# EAGLE design MagicBeater (EAGLE 9.2.0)
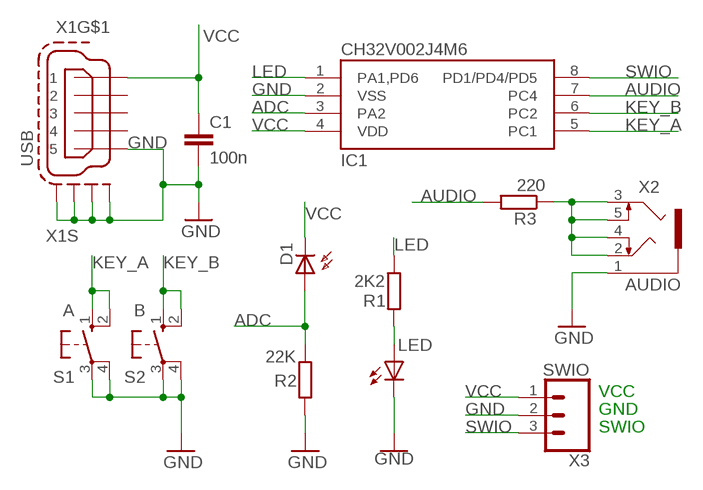
[diagram p0: schematic, sheet 1]

## Parts
C1  100n  C-EU050-024X044  [C050-024X044]
D1  BPW32  [BPW32]
IC1  CH32V002J4M6  CH32V003J4M6  [SOP8]
LED  LEDLED5MMB  [LED5MMB]
R1  2K2  R-EU_0204/7  [0204/7]
R2  22K  R-EU_0204/7  [0204/7]
R3  220  R-EU_0204/7  [0204/7]
S1  A  10-XX  [B3F-10XX]
S2  B  10-XX  [B3F-10XX]
X1  USB  MINI-USB-SCHIELD-32005-201  [32005-201]
X2  AUDIO  1503_09  [1503_09]
X3  SWIO  CONN_03LONGPADS  [1X03_LONGPADS]

## Nets
ADC: D1.A IC1.3(PA2) R2.1
AUDIO: IC1.7(PC4) R3.2
GND: C1.2 IC1.2(VSS) LED.K(C) R2.2 S1.3(P) S1.4(P1) S2.3(P) S2.4(P1) X1.5 X1.M1(S:S1) X1.M2(S:S2) X1.M3(S:S3) X1.M4(S:S4) X2.1 X3.2
KEY_A: IC1.5(PC1) S1.1(S) S1.2(S1)
KEY_B: IC1.6(PC2) S2.1(S) S2.2(S1)
LED: IC1.1(PA1,PD6) R1.1
N$2: LED.A R1.2
N$7: R3.1 X2.2 X2.3 X2.4 X2.5
SWIO: IC1.8(PD1/PD4/PD5) X3.3
VCC: C1.1 D1.K(C) IC1.4(VDD) X1.1 X3.1
Unconnected: X1.2 X1.3 X1.4

## Notes on the sheet
- VCC
- GND
- SWIO

## Library data of the parts
C1 = rcl:C-EU: CAPACITOR, European symbol; SPICEPREFIX: C
D1 = opto-trans-siemens:BPW32: PHOTO DIODE; OC_FARNELL: unknown; OC_NEWARK: unknown
IC1 = CH32V:CH32V003J4M6
LED = adafruit_B:LED: LED OSRAM: - CHIPLED LG R971, LG N971, LY N971, LG Q971, LY Q971, LO R971, LY R971 LH N974, LH R974 LS Q976, LO Q976, LY Q976 LO Q996 - Hyper CHIPLED LW Q18S LB Q993, LB Q99A, LB R99A - SideLED LS A670, LO A670, LY A670, LG A670, LP A670 LB A673, LV A673, LT A673, LW A673 LH A674 LY A675 LS A676, LA A676, LO A676, LY A676, LW A676 LS A679, LY A679, LG A679 - Hyper Micro SIDELED® LS Y876, LA Y876, LO Y876, LY Y876 LT Y87S - SmartLED LW L88C, LW L88S LB L89C, LB L89S, LG L890 LS L89K, LO L89K, LY L89K LS L896, LA L896, LO L896, LY L896 - TOPLED LS T670, LO T670, LY T670, LG T670, LP T670 LSG T670, LSP T670, LSY T670, LOP T670, LYG T670 LG T671, LOG T671, LSG T671 LB T673, LV T673, LT T673, LW T673 LH T674 LS T676, LA T676, LO T676, LY T676, LB T676, LH T676, LSB T676, LW T676 LB T67C, LV T67C, LT T67C, LS T67K, LO T67K, LY T67K, LW E67C LS E67B, LA E67B, LO E67B, LY E67B, LB E67C, LV E67C, LT E67C LW T67C LS T679, LY T679, LG T679 LS T770, LO T770, LY T770, LG T770, LP T770 LB T773, LV T773, LT T773, LW T773 LH T774 LS E675, LA E675, LY E675, LS T675 LS T776, LA T776, LO T776, LY T776, LB T776 LHGB T686 LT T68C, LB T68C - Hyper Mini TOPLED® LB M676 - Mini TOPLED Santana® LG M470 LS M47K, LO M47K, LY M47K Source: http://www.osram.convergy.de/
R1-R3 = rcl:R-EU_: RESISTOR, European symbol; SPICEPREFIX: R
S1 S2 = switch-omron:10-XX: OMRON SWITCH; MPN: B3F-1000; OC_FARNELL: 176432; OC_NEWARK: 36M3542
X1 = con-cypressindustries:MINI-USB-SCHIELD-: MINI USB-B Conector Source: www.cypressindustries.com; OC_FARNELL: unknown; OC_NEWARK: unknown
X2 = con-lumberg:1503_09: Jack connectors according to JISC 6560, 3.5 mm Klinkeneinbaukupplung nach JISC 6560, 3,5 mm, 3-polig/ stereo, abgewinkelte Ausführung, mit 2 Öffnern und Lötaugen, für Leiterplatten Rückseitenmontage Source: http://www.lumberg.com/Produkte/PDFs/1503_09.pdf; OC_FARNELL: 1243244; OC_NEWARK: unknown
X3 = SparkFun-Connectors:CONN_03: Multi connection point. Often used as Generic Header-pin footprint for 0.1 inch spaced/style header connections On any of the 0.1 inch spaced packages, you can populate with these: Break Away Headers - Straight <https://www.sparkfun.com/products/116> (PRT-00116) Break Away Male Headers - Right Angle <https://www.sparkfun.com/products/553> (PRT-00553) Female Headers <https://www.sparkfun.com/products/115> (PRT-00115) Break Away Headers - Machine Pin <https://www.sparkfun.com/products/117> (PRT-00117) Break Away Female Headers - Swiss Machine Pin <https://www.sparkfun.com/products/743> (PRT-00743) Stackable Header - 3 Pin (Female, 0.1") <https://www.sparkfun.com/products/13875> (PRT-13875) For SCREWTERMINALS and SPRING TERMINALS visit here: Screw Terimnals on SparkFun.com <https://www.sparkfun.com/search/results?term=Screw+Terminals> (5mm/3.5mm/2.54mm spacing) This device is also useful as a general connection point to wire up your design to another part of your project. Our various solder wires solder well into these plated through hole pads. Hook-Up Wire - Assortment (Stranded, 22 AWG) <https://www.sparkfun.com/products/11375> (PRT-11375) Hook-Up Wire - Assortment (Solid Core, 22 AWG) <https://www.sparkfun.com/products/11367> (PRT-11367) View the entire wire category on our website here <https://www.sparkfun.com/categories/141> Special notes: Molex polarized connector foot print use with SKU : PRT-08232 with associated crimp pins and housings.

## Board
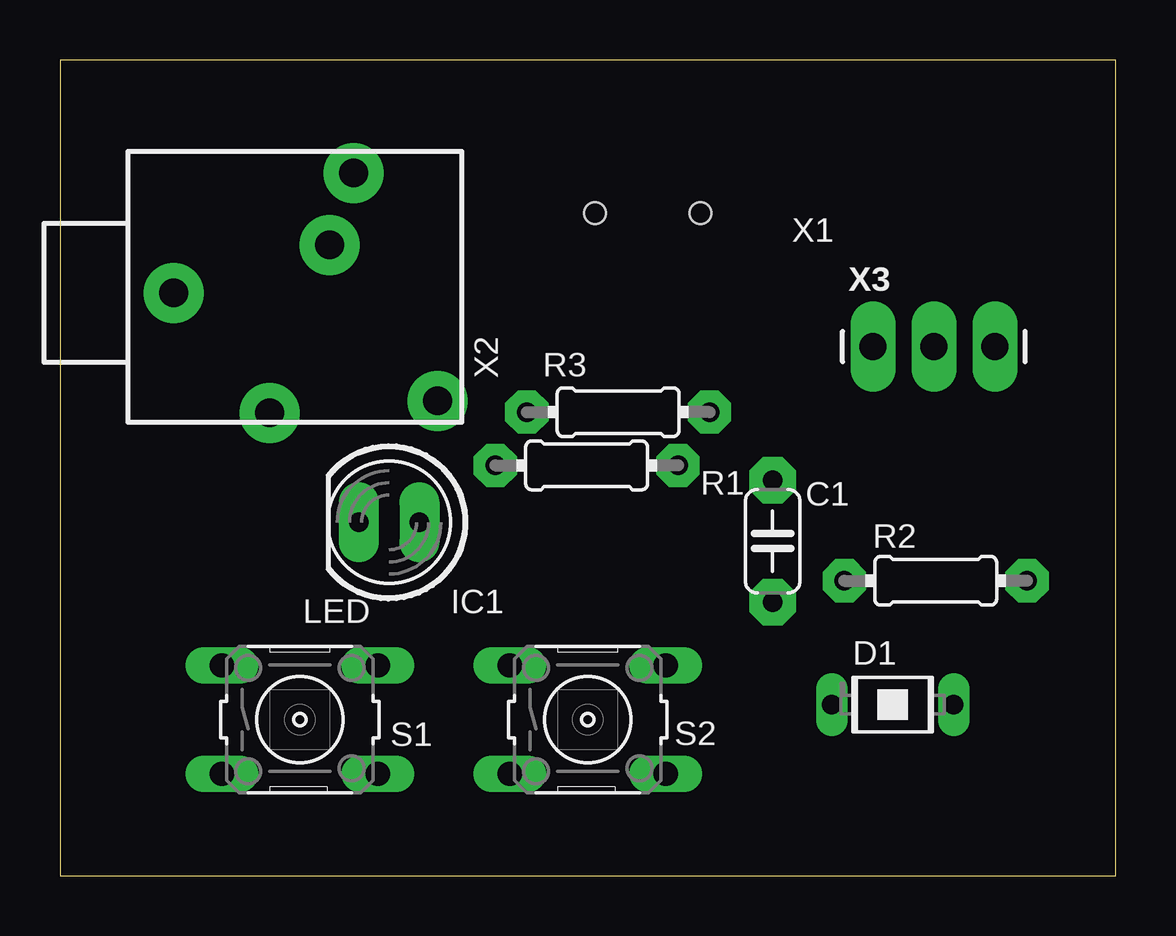
[diagram p1: board, top side]
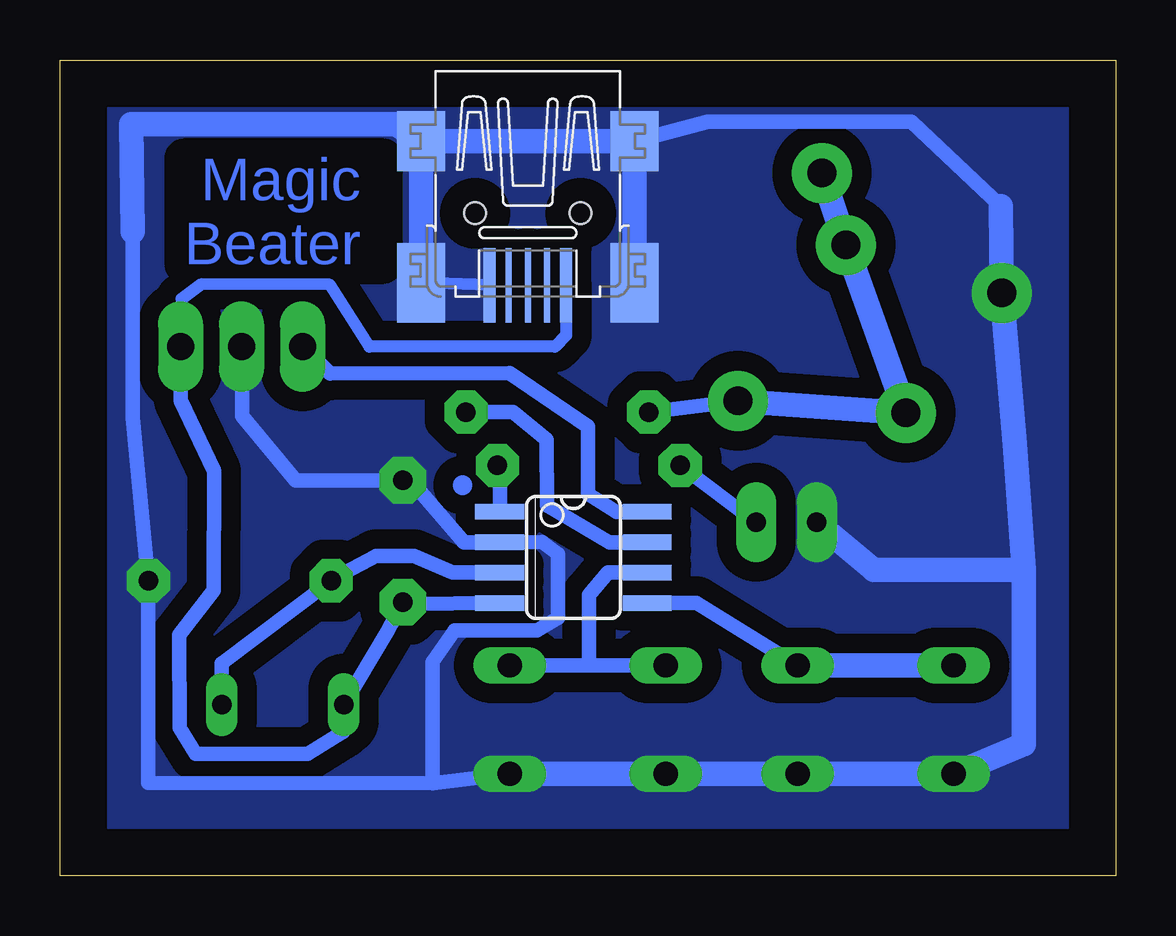
[diagram p2: board, bottom side, seen from below]

Size 44 x 34 mm. Coordinates in mm from the lower left corner, seen from the top.
Outline: 0,0 44,0 44,34 0,34 0,0
Copper layers (1*16): Top 0.035mm / dielectric 1.5mm / Bottom 0.035mm
Design rules "default": minimum track width 6mil, minimum drill 0.35mm, track to track 6mil, track to pad 6mil, pad to pad 6mil, via to via 6mil, smd to smd 6mil, copper to edge 40mil, drill to drill 6mil, minimum pad ring 10mil, minimum via ring 8mil, stop-mask expansion 4mil, vias tented up to drill 0mil, thermal gap 10mil

### Footprints (pad centres in the part's own frame; a part is rotated, then mirrored left to right if it is on the bottom)
C050-024X044 = drill 0.813 pad 1.93 octagon: 1 -2.54,0; 2 2.54,0
BPW32 = drill 0.813 long: A 0,2.54; K 0,-2.54
SOP8 = smd 0.66 x 2.032: 1 -1.905,-3.073; 2 -0.635,-3.073; 3 0.635,-3.073; 4 1.905,-3.073; 5 1.905,3.073; 6 0.635,3.073; 7 -0.635,3.073; 8 -1.905,3.073
LED5MMB = drill 0.813 pad 1.676 long: A -1.27,0; K 1.27,0
0204/7 = drill 0.813 pad 1.8 octagon: 1 -3.81,0; 2 3.81,0
B3F-10XX = drill 1.016 long: 1 -3.251,2.261; 2 3.251,2.261; 3 -3.251,-2.261; 4 3.251,-2.261
32005-201 = smd 3.1 x 0.5: 1 3,1.6; 5 3,-1.6 | smd 3.1 x 0.254: 2 3,0.8; 3 3,0; 4 3,-0.8 | smd 2.5 x 2: M1 -3,-4.45; M2 -3,4.45 | smd 3.3 x 2: M3 2.9,4.45; M4 2.9,-4.45 | hole 0.9: 0,2.2; 0,-2.2
1503_09 = drill 1.2 pad 2.5: 1 0,-2; 2 -5,-6; 3 5,-9.5; 4 -4.5,-13; 5 2,-8.5
1X03_LONGPADS = drill 1.118 pad 1.88 long: 1 0,0; 2 2.54,0; 3 5.08,0

### Placement (x,y rotation side)
C1  29.71,13.94 90 top
D1  34.71,7.12 270 top
IC1  22.6,13.26 270 bottom
LED  13.72,14.73 180 top
R1  21.96,17.1 180 top
R2  36.5,12.29 0 top
R3  23.27,19.32 0 top
S1  10,6.5 0 top
S2  22,6.5 0 top
X1  24.5,27.61 270 bottom
X2  2.74,24.29 90 top
X3  38.97,22.05 180 top

### Tracks (layer width: path | path; a pad name or v marks a point on that pad's centre or on a via)
ADC
  Bottom 0.61: IC1.3 27.64,12.63 29.23,13.31 30.83,13.31 32.46,12.45 R2.1 37.27,8.85 D1.A
AUDIO
  Bottom 0.61: R3.2 25.12,19.32 23.71,18.17 23.69,15.42 21.1,13.89 IC1.7
GND
  Bottom 0.508: X1.5 X1.M4
  Bottom 0.61: S2.4 28.47,3.85 | 28.47,3.85 40.32,3.86 R2.2 40.96,19.09 40.97,26.84 | 28.47,3.85 28.47,8.9 27.54,10.22 24.12,10.22 23.25,10.75 23.23,13.4 23.91,13.9 IC1.2 27.15,13.89 29.34,16.43 C1.2 34.17,16.48 36.41,19.16 X3.2 | X1.M2 16.98,31.42 8.51,31.42 4.79,27.91
  Bottom 1.016: S2.4 S2.3 S1.4 S1.3 3.82,5.47 3.83,12.73 | 40.97,26.84 41.02,31.32 29.96,31.33 X1.M1 | X1.M1 X1.M2 X1.M3 | 4.79,27.91 X2.1 4.2,18 3.83,12.73 | LED.K 10.07,12.73 3.83,12.73 | X1.M1 X1.M4
  pour Bottom (isolate 0.813, no thermals): 2,2 2,32 42,32 42,2
KEY_A
  Bottom 0.61: S1.2 17.46,11.36 IC1.5
  Bottom 1.016: S1.1 S1.2
KEY_B
  Bottom 0.61: S2.1 21.95,8.76 | 21.95,8.76 S2.2 | IC1.6 21.15,12.63 21.95,11.69 21.95,8.76
LED
  Bottom 0.61: R1.1 25.76,17.17 25.7,16.64 25.65,16.09 25.66,15.16 IC1.1
N$2
  Bottom 0.61: LED.A R1.2
N$7
  Bottom 0.61: X2.4 R3.1
  Bottom 1.016: X2.3 X2.5 X2.2 X2.4
SWIO
  Bottom 0.61: IC1.8 20.81,15.16 21.99,15.91 21.98,18.72 25.26,20.94 32.73,20.94 X3.3
VCC
  Bottom 0.508: X1.1 22.9,22.53 23.37,22.05 31.1,22.05 32.75,24.63 38.1,24.65 38.93,24.03 X3.1
  Bottom 0.61: IC1.4 29.5,11.33 C1.1 30.37,10.15 D1.K 32.19,5.99 33.67,5.07 38.35,5.07 39.02,6.15 39.02,10.04 37.59,11.9 37.58,16.87 38.98,19.81 X3.1
(copper drawn outside any net)
  shapes: Bottom circle x1

### Text on the board
Bottom: Magic / Beater
Document: SWIO | GND | VCC | K | A